# Altium schematic sheet can_transceiver.SchDoc
size A4; SheetNumber: 4; SheetTotal: 4
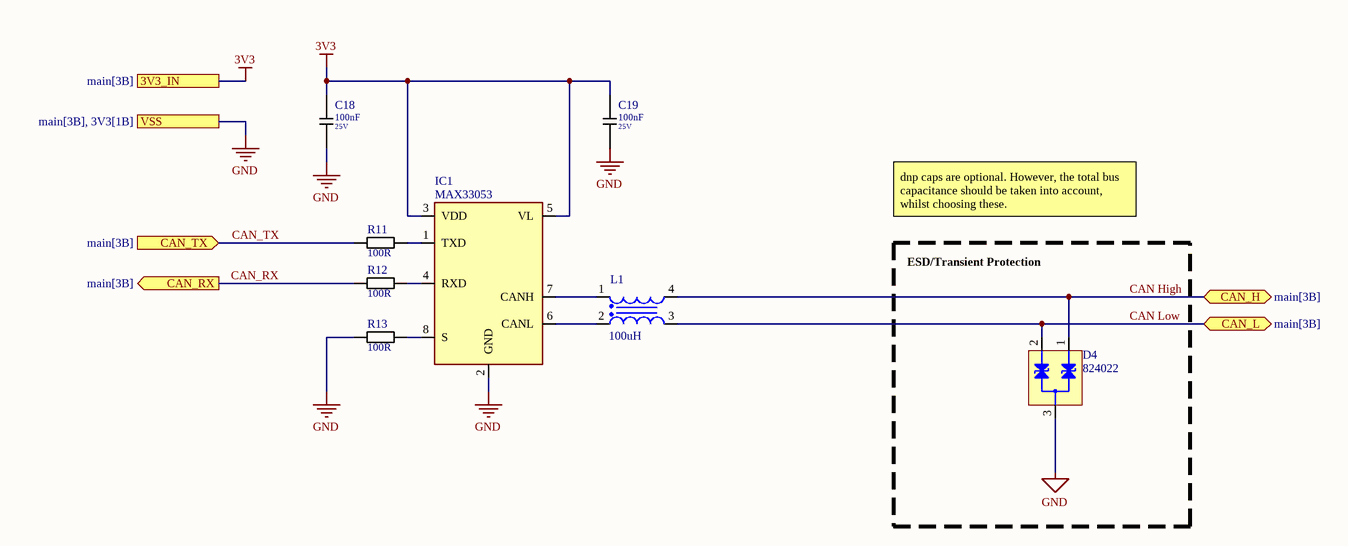
[diagram p0: can_transceiver.SchDoc]

## Parts
C18  value 100nF  Spg: 25V  [0603_C]  (hidden comment: 100nF_25V)
C19  value 100nF  Spg: 25V  [0603_C]  (hidden comment: 100nF_25V)
D4  5V  [WE-TVS_SOT23-3L]  (value not drawn)
IC1  MAX33053  [SOIC127P600X175-8N]
L1  100uH  [WE-SLM_L6W3.3H3.3]
R11  100R  [0603_R]
R12  100R  [0603_R]
R13  100R  [0603_R]

## Blocks framed on the sheet
ESD/Transient Protection: D4

## Ports
3V3_IN (see main[3B]), CAN_H (bidir, see main[3B]), CAN_L (bidir, see main[3B]), CAN_RX (out, see main[3B]), CAN_TX (in, see main[3B]), VSS (see main[3B], 3V3[1B])

## Nets
3V3: C18.1 C19.1 IC1.3(VDD) IC1.5(VL) ; port 3V3_IN
GND: C18.2 C19.2 D4.3(GND) IC1.2(GND) R13.1 ; port VSS
CAN High: D4.1(I/O_1) L1.4 ; port CAN_H
CAN Low: D4.2(I/O_2) L1.3 ; port CAN_L
CAN_RX: R12.1 ; port CAN_RX
CAN_TX: R11.1 ; port CAN_TX
NetIC1_1: IC1.1(TXD) R11.2
NetIC1_4: IC1.4(RXD) R12.2
NetIC1_6: IC1.6(CANL) L1.2
NetIC1_7: IC1.7(CANH) L1.1
NetIC1_8: IC1.8(S) R13.2

## Notes on the sheet
- dnp caps are optional. However, the total bus capacitance should be taken into account, whilst choosing these.

## Library data of the parts
C18 C19 = C_0603_Keramik: Keramikkondensatoren 0603; EBS_Nummer: %%%; HelpURL: %%%
D4 = 824022: WE-TVS TVS Diode – Standard Series, SOT23-3L, 2 Channel, 5V, 12pF; Manufacturer: Wurth Elektronik; Channel ESD Clamping Voltage: 9V; Channel Reverse Leakage Current: 2.5uA; ESD Air Discharge Capability: 20kV; ESD Contact Discharge Capability: 12kV; Number of Channels: 2; Polarity: Bidirectional; (Reverse) Breakdown Voltage: 6.1V; (Reverse) Peak Pulse Current: 8A; Category: ESD Protection; Match Code: WE-TVS; ComponentLink1Description: Website Link; ComponentLink1URL: https://www.we-online.com/redexpert/article/824022?ad; ComponentLink2Description: Datasheet Link; ComponentLink2URL: https://www.we-online.com/redexpert/spec/824022?ad; Mount: Surface Mount; Operating Temperature Max: 125°C; Operating Temperature Min: -55°C; Packaging: Tape and Reel; Case/Size Code: SOT23-3L; Length: 2.9mm; Width: 2.4mm; Height: 1.1mm; Channel Input Capacitance: 12pF; Channel Operating Voltage: 5V; Manufacturer Part Number: 824022
IC1 = MAX33053: IC TRANSCEIVER FULL 1/1 8SOIC; Manufacturer_Name: Analog Devices; Manufacturer_Part_Number: MAX33053EASA+T; Geometry.Height: 1.75mm; Mouser Part Number: 700-MAX33053EASA+T; Mouser Price/Stock: https://www.mouser.co.uk/ProductDetail/Analog-Devices-Maxim-Integrated/MAX33054EASA%2bT?qs=byeeYqUIh0NWZc497A4ngw%3D%3D; Datasheet Link: https://componentsearchengine.com/Datasheets/1/MAX33054EASA+T.pdf
L1 = 744242101: WE-SLM SMT Common Mode Line Filter, 100uH, 0.3A, 0.58Ohm; Manufacturer: Wurth Elektronik; Impedance Max: 4000Ohm; Number of Windings: 2; Rated Voltage: 80V; Winding Style: bifiliar; ComponentLink1Description: Manufacturer Link; ComponentLink1URL: https://www.we-online.com/redexpert/article/744242101?ad; ComponentLink2Description: Datasheet; ComponentLink2URL: https://www.we-online.com/redexpert/spec/744242101?ad; Category: Common Mode Chokes; Match Code: WE-SLM; Manufacturer Part Number: 744242101; Mount: Surface Mount; Operating Temperature Max: 125°C; Operating Temperature Min: -40°C; Packaging: Tape and Reel; Length: 6mm; Width: 3.3mm; Height: 3.3mm; DC Resistance Max: 0.58Ohm; Inductance: 100uH; Rated Current: 0.3A
R11-R13 = R_0603: R 0603, 75V, 0.1W; EBS_Nummer: %%%; HelpURL: %%%; Value: 100R